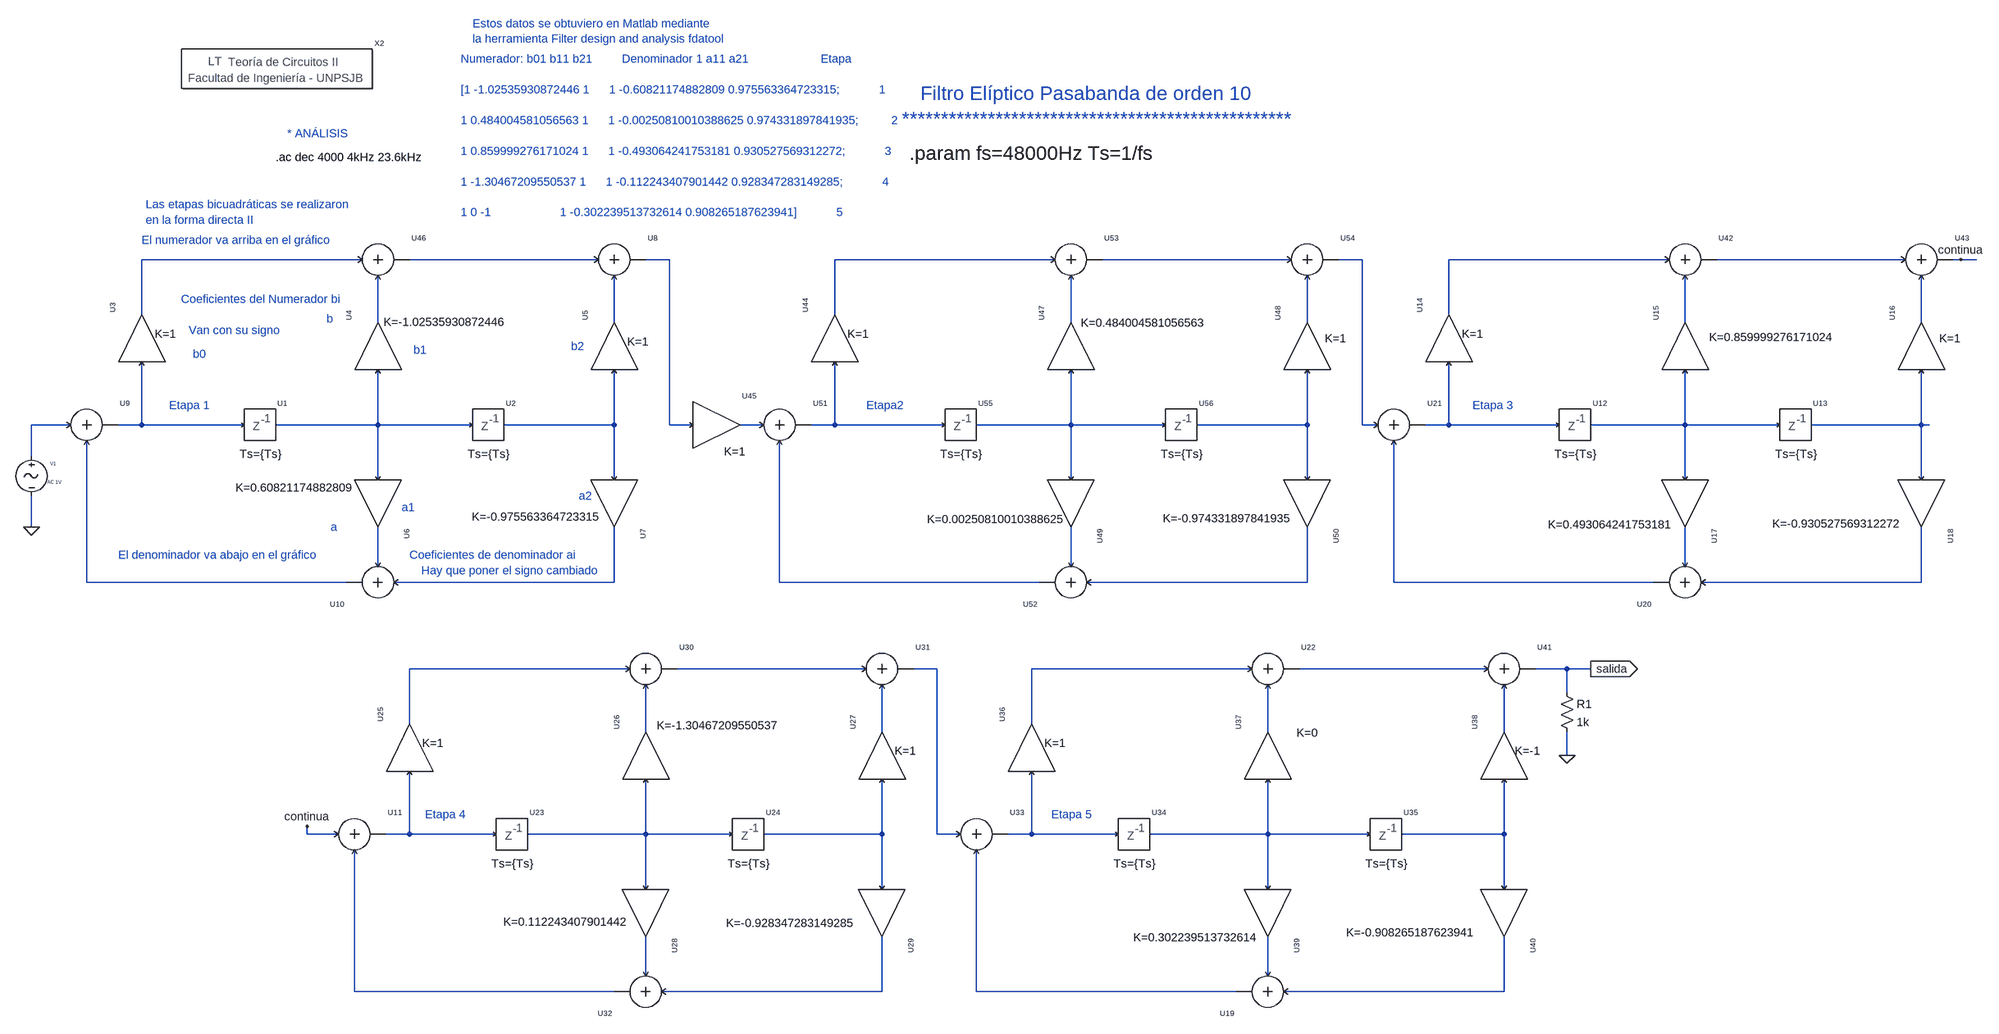
[diagram p0: schematic Filtro Digital Pasabanda de orden 10 hecho con Matlab.asc]
Filtro Digital Pasabanda de orden 10 hecho con Matlab.asc, the LTspice schematic file:
Version 4
SHEET 1 1720 680
WIRE -1968 -1104 -2416 -1104
WIRE -1488 -1104 -1872 -1104
WIRE -1344 -1104 -1392 -1104
WIRE -560 -1104 -1008 -1104
WIRE -80 -1104 -464 -1104
WIRE 64 -1104 16 -1104
WIRE 688 -1104 240 -1104
WIRE 1168 -1104 784 -1104
WIRE 1280 -1104 1264 -1104
WIRE 1312 -1104 1280 -1104
WIRE -2416 -992 -2416 -1104
WIRE -1008 -992 -1008 -1104
WIRE 240 -992 240 -1104
WIRE -1936 -976 -1936 -1072
WIRE -1456 -976 -1456 -1072
WIRE -528 -976 -528 -1072
WIRE -48 -976 -48 -1072
WIRE 720 -976 720 -1072
WIRE 1200 -976 1200 -1072
WIRE -2560 -768 -2640 -768
WIRE -2416 -768 -2416 -896
WIRE -2416 -768 -2464 -768
WIRE -2208 -768 -2416 -768
WIRE -1936 -768 -1936 -880
WIRE -1936 -768 -2144 -768
WIRE -1744 -768 -1936 -768
WIRE -1456 -768 -1456 -880
WIRE -1456 -768 -1680 -768
WIRE -1344 -768 -1344 -1104
WIRE -1296 -768 -1344 -768
WIRE -1152 -768 -1200 -768
WIRE -1008 -768 -1008 -896
WIRE -1008 -768 -1056 -768
WIRE -784 -768 -1008 -768
WIRE -528 -768 -528 -880
WIRE -528 -768 -720 -768
WIRE -336 -768 -528 -768
WIRE -48 -768 -48 -880
WIRE -48 -768 -272 -768
WIRE 64 -768 64 -1104
WIRE 96 -768 64 -768
WIRE 240 -768 240 -896
WIRE 240 -768 192 -768
WIRE 464 -768 240 -768
WIRE 720 -768 720 -880
WIRE 720 -768 528 -768
WIRE 912 -768 720 -768
WIRE 1200 -768 1200 -880
WIRE 1200 -768 976 -768
WIRE 1216 -768 1200 -768
WIRE -2640 -704 -2640 -768
WIRE -1936 -656 -1936 -768
WIRE -1456 -656 -1456 -768
WIRE -528 -656 -528 -768
WIRE -48 -656 -48 -768
WIRE 720 -656 720 -768
WIRE 1200 -656 1200 -768
WIRE -2640 -560 -2640 -624
WIRE -1936 -480 -1936 -560
WIRE -528 -480 -528 -560
WIRE 720 -480 720 -560
WIRE -2528 -448 -2528 -736
WIRE -2000 -448 -2528 -448
WIRE -1456 -448 -1456 -560
WIRE -1456 -448 -1904 -448
WIRE -1120 -448 -1120 -736
WIRE -592 -448 -1120 -448
WIRE -48 -448 -48 -560
WIRE -48 -448 -496 -448
WIRE 128 -448 128 -736
WIRE 656 -448 128 -448
WIRE 1200 -448 1200 -560
WIRE 1200 -448 752 -448
WIRE -1424 -272 -1872 -272
WIRE -944 -272 -1328 -272
WIRE -800 -272 -848 -272
WIRE -160 -272 -608 -272
WIRE 320 -272 -64 -272
WIRE 480 -272 416 -272
WIRE 528 -272 480 -272
WIRE 480 -224 480 -272
WIRE -1872 -160 -1872 -272
WIRE -608 -160 -608 -272
WIRE -1392 -144 -1392 -240
WIRE -912 -144 -912 -240
WIRE -128 -144 -128 -240
WIRE 352 -144 352 -240
WIRE 480 -96 480 -144
WIRE -2080 64 -2080 48
WIRE -2016 64 -2080 64
WIRE -1872 64 -1872 -64
WIRE -1872 64 -1920 64
WIRE -1696 64 -1872 64
WIRE -1392 64 -1392 -48
WIRE -1392 64 -1632 64
WIRE -1216 64 -1392 64
WIRE -912 64 -912 -48
WIRE -912 64 -1152 64
WIRE -800 64 -800 -272
WIRE -752 64 -800 64
WIRE -608 64 -608 -64
WIRE -608 64 -656 64
WIRE -432 64 -608 64
WIRE -128 64 -128 -48
WIRE -128 64 -368 64
WIRE 80 64 -128 64
WIRE 352 64 352 -48
WIRE 352 64 144 64
WIRE -1392 176 -1392 64
WIRE -912 176 -912 64
WIRE -128 176 -128 64
WIRE 352 176 352 64
WIRE -1392 352 -1392 272
WIRE -128 352 -128 272
WIRE -1984 384 -1984 96
WIRE -1456 384 -1984 384
WIRE -912 384 -912 272
WIRE -912 384 -1360 384
WIRE -720 384 -720 96
WIRE -192 384 -720 384
WIRE 352 384 352 272
WIRE 352 384 -96 384
FLAG 1280 -1104 continua
FLAG 480 -96 0
FLAG 528 -272 salida
IOPIN 528 -272 Out
FLAG -2640 -560 0
FLAG -2080 48 continua
SYMBOL ganancia -2416 -944 R270
WINDOW 39 9 48 VCenter 2
SYMATTR InstName U3
SYMBOL ganancia -1936 -928 R270
WINDOW 39 49 135 VCenter 2
SYMATTR SpiceLine K=-1.02535930872446
SYMATTR InstName U4
SYMBOL ganancia -1456 -928 R270
WINDOW 39 9 48 VCenter 2
SYMATTR InstName U5
SYMBOL ganancia -1936 -608 R90
WINDOW 39 -32 170 VCenter 2
SYMATTR SpiceLine K=0.60821174882809
SYMATTR InstName U6
SYMBOL ganancia -1456 -608 R90
WINDOW 39 27 159 VCenter 2
SYMATTR SpiceLine K=-0.975563364723315
SYMATTR InstName U7
SYMBOL ganancia 240 -944 R270
WINDOW 39 9 48 VCenter 2
SYMATTR InstName U14
SYMBOL ganancia 720 -928 R270
WINDOW 39 18 175 VCenter 2
SYMATTR SpiceLine K=0.859999276171024
SYMATTR InstName U15
SYMBOL ganancia 1200 -928 R270
WINDOW 39 16 58 VCenter 2
SYMATTR InstName U16
SYMBOL ganancia 720 -608 R90
WINDOW 39 43 152 VCenter 2
SYMATTR SpiceLine K=0.493064241753181
SYMATTR InstName U17
SYMBOL ganancia 1200 -608 R90
WINDOW 39 41 172 VCenter 2
SYMATTR SpiceLine K=-0.930527569312272
SYMATTR InstName U18
SYMBOL ganancia -1872 -112 R270
WINDOW 39 9 48 VCenter 2
SYMATTR InstName U25
SYMBOL ganancia -1392 -96 R270
WINDOW 39 61 146 VCenter 2
SYMATTR SpiceLine K=-1.30467209550537
SYMATTR InstName U26
SYMBOL ganancia -912 -96 R270
WINDOW 39 9 48 VCenter 2
SYMATTR InstName U27
SYMBOL ganancia -1392 224 R90
WINDOW 39 18 163 VCenter 2
SYMATTR SpiceLine K=0.112243407901442
SYMATTR InstName U28
SYMBOL ganancia -912 224 R90
WINDOW 39 21 186 VCenter 2
SYMATTR SpiceLine K=-0.928347283149285
SYMATTR InstName U29
SYMBOL ganancia -608 -112 R270
WINDOW 39 9 48 VCenter 2
SYMATTR InstName U36
SYMBOL ganancia -128 -96 R270
WINDOW 39 46 80 VCenter 2
SYMATTR SpiceLine K=0
SYMATTR InstName U37
SYMBOL ganancia 352 -96 R270
WINDOW 39 9 48 VCenter 2
SYMATTR SpiceLine K=-1
SYMATTR InstName U38
SYMBOL ganancia -128 224 R90
WINDOW 39 50 147 VCenter 2
SYMATTR SpiceLine K=0.302239513732614
SYMATTR InstName U39
SYMBOL ganancia 352 224 R90
WINDOW 39 40 190 VCenter 2
SYMATTR SpiceLine K=-0.908265187623941
SYMATTR InstName U40
SYMBOL Vac -2640 -672 R0
SYMATTR InstName V1
SYMBOL res 464 -240 R0
SYMATTR InstName R1
SYMATTR Value 1k
SYMBOL ganancia -1248 -768 R0
WINDOW 39 37 54 Center 2
SYMATTR InstName U45
SYMBOL Sumaf -1888 -1104 R0
SYMATTR InstName U46
SYMBOL Sumaf -1408 -1104 R0
SYMATTR InstName U8
SYMBOL Sumaf -2480 -768 R0
SYMATTR InstName U9
SYMBOL Sumaf -1936 64 R0
SYMATTR InstName U11
SYMBOL Sumaf -1440 384 R180
SYMATTR InstName U32
SYMBOL Sumaf -1344 -272 R0
SYMATTR InstName U30
SYMBOL Sumaf -864 -272 R0
SYMATTR InstName U31
SYMBOL Sumaf -672 64 R0
SYMATTR InstName U33
SYMBOL Sumaf 176 -768 R0
SYMATTR InstName U21
SYMBOL Sumaf -176 384 R180
SYMATTR InstName U19
SYMBOL Sumaf 672 -448 R180
SYMATTR InstName U20
SYMBOL Sumaf -80 -272 R0
SYMATTR InstName U22
SYMBOL Sumaf 400 -272 R0
SYMATTR InstName U41
SYMBOL Sumaf 768 -1104 R0
SYMATTR InstName U42
SYMBOL Sumaf 1248 -1104 R0
SYMATTR InstName U43
SYMBOL retardozs -2176 -768 R0
SYMATTR InstName U1
SYMBOL retardozs -1712 -768 R0
SYMATTR InstName U2
SYMBOL retardozs 496 -768 R0
SYMATTR InstName U12
SYMBOL retardozs 944 -768 R0
SYMATTR InstName U13
SYMBOL retardozs -1664 64 R0
SYMATTR InstName U23
SYMBOL retardozs -1184 64 R0
SYMATTR InstName U24
SYMBOL retardozs -400 64 R0
SYMATTR InstName U34
SYMBOL retardozs 112 64 R0
SYMATTR InstName U35
SYMBOL ganancia -1008 -944 R270
WINDOW 39 9 48 VCenter 2
SYMATTR InstName U44
SYMBOL ganancia -528 -928 R270
WINDOW 39 47 147 VCenter 2
SYMATTR SpiceLine K=0.484004581056563
SYMATTR InstName U47
SYMBOL ganancia -48 -928 R270
WINDOW 39 16 58 VCenter 2
SYMATTR InstName U48
SYMBOL ganancia -528 -608 R90
WINDOW 39 32 152 VCenter 2
SYMATTR SpiceLine K=0.00250810010388625
SYMATTR InstName U49
SYMBOL ganancia -48 -608 R90
WINDOW 39 30 163 VCenter 2
SYMATTR SpiceLine K=-0.974331897841935
SYMATTR InstName U50
SYMBOL Sumaf -1072 -768 R0
SYMATTR InstName U51
SYMBOL Sumaf -576 -448 R180
SYMATTR InstName U52
SYMBOL Sumaf -480 -1104 R0
SYMATTR InstName U53
SYMBOL Sumaf 0 -1104 R0
SYMATTR InstName U54
SYMBOL retardozs -752 -768 R0
SYMATTR InstName U55
SYMBOL retardozs -304 -768 R0
SYMATTR InstName U56
SYMBOL Sumaf -1984 -448 R180
SYMATTR InstName U10
SYMBOL Circuitos2\\Letreros\\Teoría\ de\ Circuitos\ II -2144 -1488 R0
SYMATTR InstName X2
TEXT -496 -1416 Center 4 ;Filtro Elíptico Pasabanda de orden 10\n**************************************************
TEXT -2040 -984 Left 2 ;b
TEXT -2032 -560 Left 2 ;a
TEXT -2144 -1312 Left 2 !.ac dec 4000 4kHz 23.6kHz
TEXT -856 -1320 Left 4 !.param fs=48000Hz Ts=1/fs
TEXT -2360 -808 Left 2 ;Etapa 1
TEXT -944 -808 Left 2 ;Etapa2
TEXT 288 -808 Left 2 ;Etapa 3
TEXT -1840 24 Left 2 ;Etapa 4
TEXT -568 24 Left 2 ;Etapa 5
TEXT -2336 -1024 Left 2 ;Coeficientes del Numerador bi
TEXT -1872 -504 Left 2 ;Coeficientes de denominador ai
TEXT -1848 -472 Left 2 ;Hay que poner el signo cambiado
TEXT -2320 -960 Left 2 ;Van con su signo
TEXT -1768 -1512 Left 2 ;Numerador: b01 b11 b21         Denominador 1 a11 a21                      Etapa\n \n[1 -1.02535930872446 1      1 -0.60821174882809 0.975563364723315;            1\n \n1 0.484004581056563 1      1 -0.00250810010388625 0.974331897841935;          2\n \n1 0.859999276171024 1      1 -0.493064241753181 0.930527569312272;            3\n \n1 -1.30467209550537 1      1 -0.112243407901442 0.928347283149285;            4\n \n1 0 -1                     1 -0.302239513732614 0.908265187623941]            5
TEXT -2416 -1144 Left 2 ;El numerador va arriba en el gráfico
TEXT -2464 -504 Left 2 ;El denominador va abajo en el gráfico
TEXT -2312 -912 Left 2 ;b0
TEXT -1864 -920 Left 2 ;b1
TEXT -1544 -928 Left 2 ;b2
TEXT -1888 -600 Left 2 ;a1
TEXT -1528 -624 Left 2 ;a2
TEXT -1744 -1584 Left 2 ;Estos datos se obtuviero en Matlab mediante\nla herramienta Filter design and analysis fdatool
TEXT -2408 -1216 Left 2 ;Las etapas bicuadráticas se realizaron\nen la forma directa II
TEXT -2120 -1360 Left 2 ;* ANÁLISIS

The netlist it stands for:
* Filtro Digital Pasabanda de orden 10 hecho con Matlab.asc
XU3 N016 N001 ganancia K=1  ; pins en sal
XU4 N017 N009 ganancia K=-1.02535930872446  ; pins en sal
XU5 N018 N010 ganancia K=1  ; pins en sal
XU6 N017 N026 ganancia K=0.60821174882809  ; pins en sal
XU7 N018 N030 ganancia K=-0.975563364723315  ; pins en sal
XU14 N023 N007 ganancia K=1  ; pins en sal
XU15 N024 N013 ganancia K=0.859999276171024  ; pins en sal
XU16 N025 N014 ganancia K=1  ; pins en sal
XU17 N024 N028 ganancia K=0.493064241753181  ; pins en sal
XU18 N025 N034 ganancia K=-0.930527569312272  ; pins en sal
XU25 N044 N035 ganancia K=1  ; pins en sal
XU26 N045 N040 ganancia K=-1.30467209550537  ; pins en sal
XU27 N046 N041 ganancia K=1  ; pins en sal
XU28 N045 N050 ganancia K=0.112243407901442  ; pins en sal
XU29 N046 N053 ganancia K=-0.928347283149285  ; pins en sal
XU36 N047 N038 ganancia K=1  ; pins en sal
XU37 N048 N042 ganancia K=0  ; pins en sal
XU38 N049 N043 ganancia K=-1  ; pins en sal
XU39 N048 N051 ganancia K=0.302239513732614  ; pins en sal
XU40 N049 N055 ganancia K=-0.908265187623941  ; pins en sal
V1 N015 0 AC 1V
R1 salida 0 1k
XU45 N003 N019 ganancia K=1  ; pins en sal
XU46 N001 N009 N002 Sumaf  ; pins in1 in2 out
XU8 N002 N010 N003 Sumaf  ; pins in1 in2 out
XU9 N015 N029 N016 Sumaf  ; pins in1 in2 out
XU11 continua N052 N044 Sumaf  ; pins in1 in2 out
XU32 N053 N050 N052 Sumaf  ; pins in1 in2 out
XU30 N035 N040 N036 Sumaf  ; pins in1 in2 out
XU31 N036 N041 N037 Sumaf  ; pins in1 in2 out
XU33 N037 N054 N047 Sumaf  ; pins in1 in2 out
XU21 N006 N033 N023 Sumaf  ; pins in1 in2 out
XU19 N055 N051 N054 Sumaf  ; pins in1 in2 out
XU20 N034 N028 N033 Sumaf  ; pins in1 in2 out
XU22 N038 N042 N039 Sumaf  ; pins in1 in2 out
XU41 N039 N043 salida Sumaf  ; pins in1 in2 out
XU42 N007 N013 N008 Sumaf  ; pins in1 in2 out
XU43 N008 N014 continua Sumaf  ; pins in1 in2 out
XU1 N016 N017 retardozs Ts={Ts}  ; pins ent sal
XU2 N017 N018 retardozs Ts={Ts}  ; pins ent sal
XU12 N023 N024 retardozs Ts={Ts}  ; pins ent sal
XU13 N024 N025 retardozs Ts={Ts}  ; pins ent sal
XU23 N044 N045 retardozs Ts={Ts}  ; pins ent sal
XU24 N045 N046 retardozs Ts={Ts}  ; pins ent sal
XU34 N047 N048 retardozs Ts={Ts}  ; pins ent sal
XU35 N048 N049 retardozs Ts={Ts}  ; pins ent sal
XU44 N020 N004 ganancia K=1  ; pins en sal
XU47 N021 N011 ganancia K=0.484004581056563  ; pins en sal
XU48 N022 N012 ganancia K=1  ; pins en sal
XU49 N021 N027 ganancia K=0.00250810010388625  ; pins en sal
XU50 N022 N032 ganancia K=-0.974331897841935  ; pins en sal
XU51 N019 N031 N020 Sumaf  ; pins in1 in2 out
XU52 N032 N027 N031 Sumaf  ; pins in1 in2 out
XU53 N004 N011 N005 Sumaf  ; pins in1 in2 out
XU54 N005 N012 N006 Sumaf  ; pins in1 in2 out
XU55 N020 N021 retardozs Ts={Ts}  ; pins ent sal
XU56 N021 N022 retardozs Ts={Ts}  ; pins ent sal
XU10 N030 N026 N029 Sumaf  ; pins in1 in2 out
XX2 Teoría de Circuitos II
* Filtro Elíptico Pasabanda de orden 10
* **************************************************
* b
* a
.ac dec 4000 4kHz 23.6kHz
.param fs=48000Hz Ts=1/fs
* Etapa 1
* Etapa2
* Etapa 3
* Etapa 4
* Etapa 5
* Coeficientes del Numerador bi
* Coeficientes de denominador ai
* Hay que poner el signo cambiado
* Van con su signo
* Numerador: b01 b11 b21         Denominador 1 a11 a21                      Etapa
* [1 -1.02535930872446 1      1 -0.60821174882809 0.975563364723315;            1
* 1 0.484004581056563 1      1 -0.00250810010388625 0.974331897841935;          2
* 1 0.859999276171024 1      1 -0.493064241753181 0.930527569312272;            3
* 1 -1.30467209550537 1      1 -0.112243407901442 0.928347283149285;            4
* 1 0 -1                     1 -0.302239513732614 0.908265187623941]            5
* El numerador va arriba en el gráfico
* El denominador va abajo en el gráfico
* b0
* b1
* b2
* a1
* a2
* Estos datos se obtuviero en Matlab mediante
* la herramienta Filter design and analysis fdatool
* Las etapas bicuadráticas se realizaron
* en la forma directa II
* * ANÁLISIS
.lib ..\sym\Circuitos2\Bloques\Bloques.lib
.lib ..\sym\Circuitos2\FiltrosDigitales\filtrosdigitales.lib
.backanno
.end